# EAGLE schematic harp rfid reader (EAGLE 9.5.1)

## Sheet 1 of 2
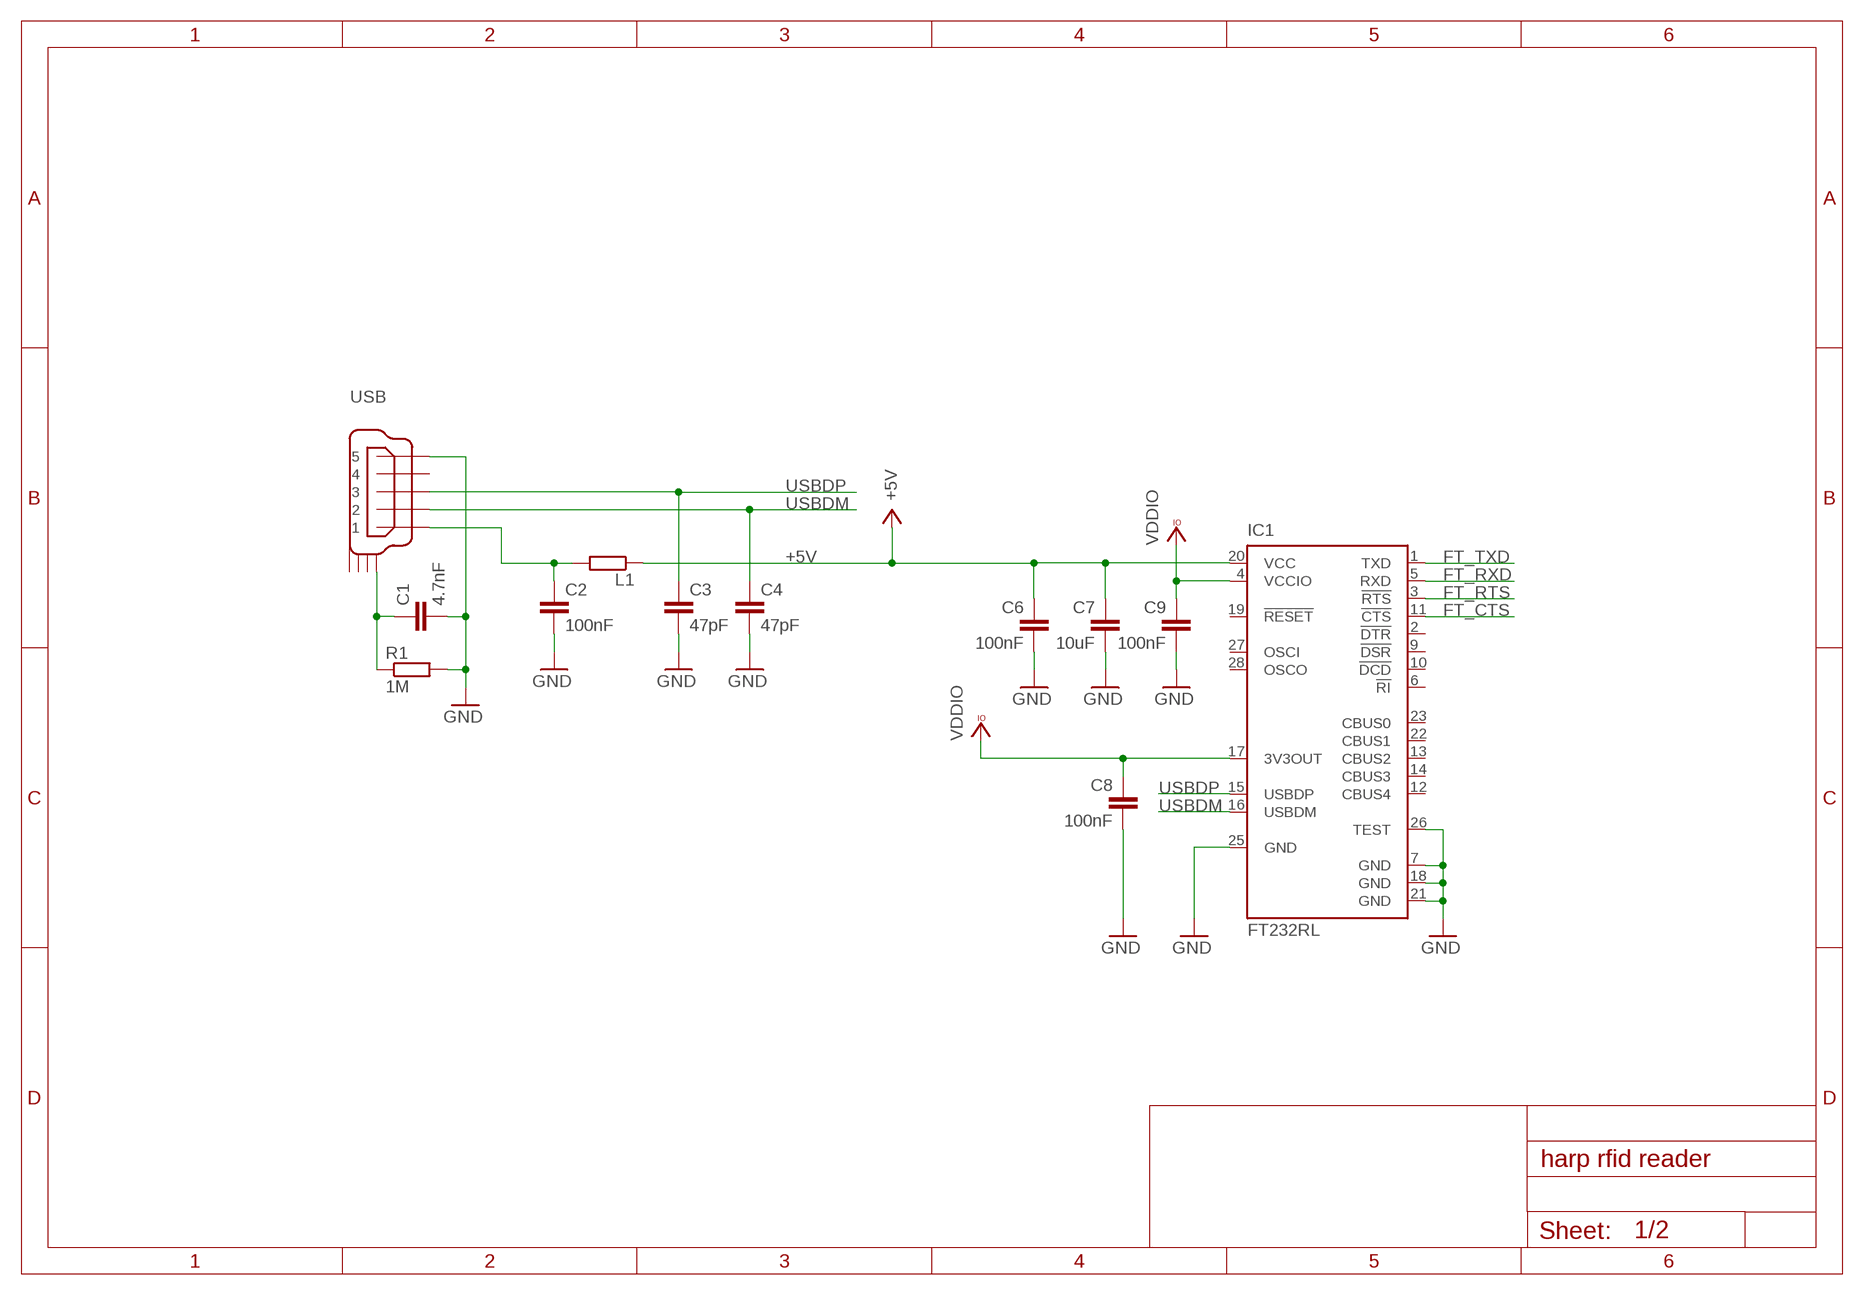
[diagram p0: schematic, sheet 1]

### Parts
C1  4.7nF  C-EUC0402  [C0402]
C2  100nF  C-EUC0402  [C0402]
C3  47pF  C-EUC0402  [C0402]
C4  47pF  C-EUC0402  [C0402]
C6  100nF  C-EUC0402  [C0402]
C7  10uF  C-EUC0603  [C0603]
C8  100nF  C-EUC0402  [C0402]
C9  100nF  C-EUC0402  [C0402]
IC1  FT232RL  [SSOP28]
L1  ???  R-EU_R0805  [R0805]
R1  1M  R-EU_R0402  [R0402]
USB  USB_MINI_B  [240-0002-1]

### Nets
+5V: C6.1 C7.1 IC1.20(VCC) L1.1 ; also sheet 2
FT_CTS: IC1.11(!CTS) ; also sheet 2
FT_RTS: IC1.3(!RTS) ; also sheet 2
FT_RXD: IC1.5(RXD) ; also sheet 2
FT_TXD: IC1.1(TXD) ; also sheet 2
GND: C1.2 C2.2 C3.2 C4.2 C6.2 C7.2 C8.2 C9.2 IC1.7(GND) IC1.18(GND) IC1.21(GND) IC1.25(GND) IC1.26(TEST) R1.2 USB.P$5 ; also sheet 2
N$3: C1.1 R1.1 USB.SHIELD_1
N$39: C2.1 L1.2 USB.P$1
USBDM: C4.1 IC1.16(USBDM) USB.P$2
USBDP: C3.1 IC1.15(USBDP) USB.P$3
VCCIO: C8.1 C9.1 IC1.4(VCCIO) IC1.17(3V3OUT) ; supply symbol labelled VDDIO ; also sheet 2
Unconnected: IC1.2(!DTR) IC1.6(!RI) IC1.9(!DSR) IC1.10(!DCD) IC1.12(CBUS4) IC1.13(CBUS2) IC1.14(CBUS3) IC1.19(!RESET) IC1.22(CBUS1) IC1.23(CBUS0) IC1.27(OSCI) IC1.28(OSCO) USB.P$4 USB.SHIELD_2 USB.SHIELD_3 USB.SHIELD_4

## Sheet 2 of 2
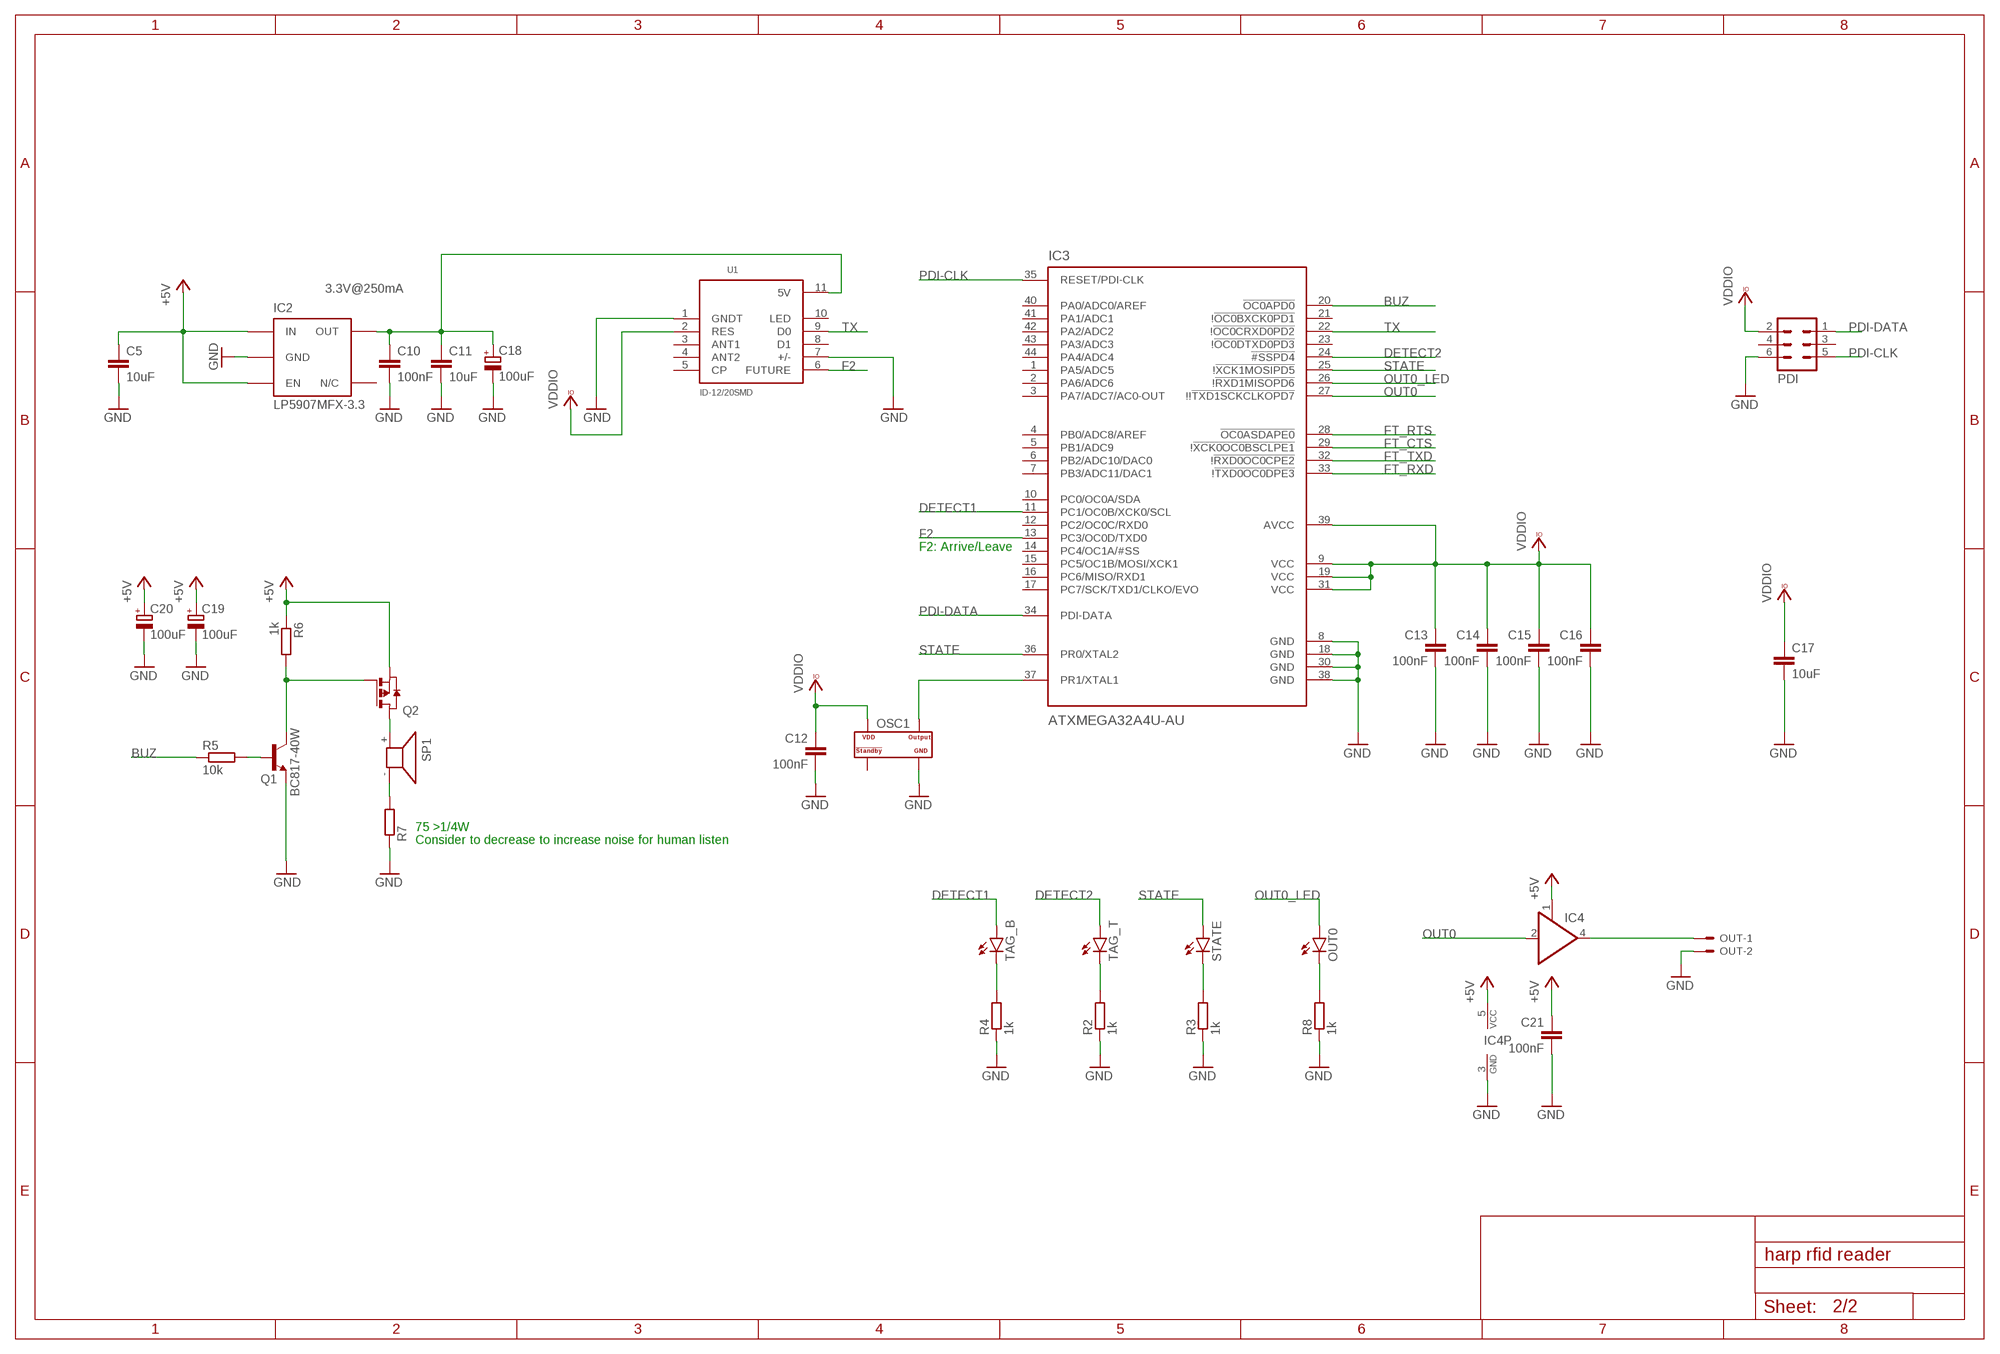
[diagram p1: schematic, sheet 2]

### Parts
C5  10uF  C-EUC0603  [C0603]
C10  100nF  C-EUC0402  [C0402]
C11  10uF  C-EUC0603  [C0603]
C12  100nF  C-EUC0402  [C0402]
C13  100nF  C-EUC0402  [C0402]
C14  100nF  C-EUC0402  [C0402]
C15  100nF  C-EUC0402  [C0402]
C16  100nF  C-EUC0402  [C0402]
C17  10uF  C-EUC0603  [C0603]
C18  100uF  CPOL-EUCT3216  [CT3216]
C19  100uF  CPOL-EUCT3216  [CT3216]
C20  100uF  CPOL-EUCT3216  [CT3216]
C21  100nF  C-EUC0402  [C0402]
IC2  LP5907MFX-3.3  TLV700XX  [TSOT23-5]
IC3  ATXMEGA32A4U-AU  AT-XMEGA-XXA4-AU  [QFP80P1200X1200X120-44N]
IC4  74AHC1G126DBV  [SOT23-5]
OSC1  CNP-MISCELLANEOUS_OSCILLATOR  [CNP-MISCELLANEOUS_OSCILLATOR_3.2X2.5]
OUT  22-23-2021  [22-23-2021]
OUT0  LEDCHIP-LED0603  [CHIP-LED0603]
PDI  MA03-2  [MA03-2]
Q1  BC817-40W  BC817  [SOT323-BEC]
Q2  PMOSSOT223  [SOT223]
R2  1k  R-EU_R0402  [R0402]
R3  1k  R-EU_R0402  [R0402]
R4  1k  R-EU_R0402  [R0402]
R5  10k  R-EU_R0402  [R0402]
R6  1k  R-EU_R0402  [R0402]
R7  75 >1/4W  R-EU_R0402  [R0402]
R8  1k  R-EU_R0402  [R0402]
SP1  BUZZER-COIL_SMT-0540-S-R  [BUZZER-COIL_SMT-0540-S-R]
STATE  LEDCHIP-LED0603  [CHIP-LED0603]
TAG_B  LEDCHIP-LED0603  [CHIP-LED0603]
TAG_T  LEDCHIP-LED0603  [CHIP-LED0603]
U1  ID-12/20SMD  [ID-12_SMD]

### Nets
+5V: C5.1 C19.+ C20.+ C21.1 IC2.1(IN) IC2.3(EN) IC4.1(OE) IC4.5(VCC) Q2.3(S) R6.1 ; also sheet 1
BUZ: IC3.20(!OC0APD0) R5.1
BUZ_T: Q2.2(D) Q2.4(D) SP1.+
DETECT1: IC3.11(PC1/OC0B/XCK0/SCL) TAG_B.A
DETECT2: IC3.24(!#SSPD4) TAG_T.A
F2: IC3.13(PC3/OC0D/TXD0) U1.6(FUTURE)
FT_CTS: IC3.29(!!XCK0OC0BSCLPE1) ; also sheet 1
FT_RTS: IC3.28(!OC0ASDAPE0) ; also sheet 1
FT_RXD: IC3.33(!!TXD0OC0DPE3) ; also sheet 1
FT_TXD: IC3.32(!!RXD0OC0CPE2) ; also sheet 1
GND: C5.2 C10.2 C11.2 C12.2 C13.2 C14.2 C15.2 C16.2 C17.2 C18.- C19.- C20.- C21.2 IC2.2(GND) IC3.8(GND) IC3.18(GND) IC3.30(GND) IC3.38(GND) IC4.3(GND) OSC1.P$2(GND) OUT.2 PDI.6 Q1.E R2.1 R3.1 R4.1 R7.1 R8.1 U1.1(GNDT) U1.7(+/-) ; also sheet 1
N$1: C10.1 C11.1 C18.+ IC2.5(OUT) U1.11(5V)
N$2: R3.2 STATE.C
N$4: R4.2 TAG_B.C
N$5: R2.2 TAG_T.C
N$6: OUT0.C R8.2
N$7: IC4.4(O) OUT.1
N$20: R7.2 SP1.-
N$25: Q1.C Q2.1(G) R6.2
N$27: Q1.B R5.2
OSC1: IC3.37(PR1/XTAL1) OSC1.P$3(OUTPUT)
OUT0: IC3.27(!!!TXD1SCKCLKOPD7) IC4.2(I)
OUT0_LED: IC3.26(!!RXD1MISOPD6) OUT0.A
PDI-CLK: IC3.35(RESET/PDI-CLK) PDI.5
PDI-DATA: IC3.34(PDI-DATA) PDI.1
STATE: IC3.25(!!XCK1MOSIPD5) IC3.36(PR0/XTAL2) STATE.A
TX: IC3.22(!!OC0CRXD0PD2) U1.9(D0)
VCCIO: C12.1 C13.1 C14.1 C15.1 C16.1 C17.1 IC3.9(VCC) IC3.19(VCC) IC3.31(VCC) IC3.39(AVCC) OSC1.P$4(VDD) PDI.2 U1.2(RES) ; supply symbol labelled VDDIO ; also sheet 1
Unconnected: IC2.4(N/C) IC3.1(PA5/ADC5) IC3.2(PA6/ADC6) IC3.3(PA7/ADC7/AC0-OUT) IC3.4(PB0/ADC8/AREF) IC3.5(PB1/ADC9) IC3.6(PB2/ADC10/DAC0) IC3.7(PB3/ADC11/DAC1) IC3.10(PC0/OC0A/SDA) IC3.12(PC2/OC0C/RXD0) IC3.14(PC4/OC1A/#SS) IC3.15(PC5/OC1B/MOSI/XCK1) IC3.16(PC6/MISO/RXD1) IC3.17(PC7/SCK/TXD1/CLKO/EVO) IC3.21(!!OC0BXCK0PD1) IC3.23(!!OC0DTXD0PD3) IC3.40(PA0/ADC0/AREF) IC3.41(PA1/ADC1) IC3.42(PA2/ADC2) IC3.43(PA3/ADC3) IC3.44(PA4/ADC4) OSC1.P$1(STANDBY#) PDI.3 PDI.4 U1.3(ANT1) U1.4(ANT2) U1.5(CP) U1.8(D1) U1.10(LED)

### Notes on the sheet
- 3.3V@250mA
- F2: Arrive/Leave
- 75 >1/4W
- Consider to decrease to increase noise for human listen

## Library data of the parts
C1-C17 C21 = rcl:C-EU: CAPACITOR, European symbol
C18-C20 = rcl:CPOL-EU: POLARIZED CAPACITOR, European symbol; SPICEPREFIX: C
IC1 = ftdichip:FT232R: Source: http://www.ftdichip.com/Documents/DataSheets/DS_FT232R_v104.pdf; MPN: FT232RL; OC_FARNELL: 1146032; OC_NEWARK: 91K9918
IC2 = CNP:TLV700XX
IC3 = xmega-a4:AT-XMEGA-XXA4-AU: ATxMega a4 Serie
IC4 = 74xx-little-de:74*1G126: Single Bus Buffer Gate With 3-State Outputs
L1 R1 R5-R7 = rcl:R-EU_: RESISTOR, European symbol
OSC1 = harp rfid reader v1.0:CNP-MISCELLANEOUS_OSCILLATOR
OUT = con-molex:22-23-2021: .100" (2.54mm) Center Header - 2 Pin; MF: MOLEX; MPN: 22-23-2021; OC_FARNELL: 1462926; OC_NEWARK: 25C3832
OUT0 STATE TAG_B TAG_T = led:LED: LED OSRAM: - CHIPLED LG R971, LG N971, LY N971, LG Q971, LY Q971, LO R971, LY R971 LH N974, LH R974 LS Q976, LO Q976, LY Q976 LO Q996 - Hyper CHIPLED LW Q18S LB Q993, LB Q99A, LB R99A - SideLED LS A670, LO A670, LY A670, LG A670, LP A670 LB A673, LV A673, LT A673, LW A673 LH A674 LY A675 LS A676, LA A676, LO A676, LY A676, LW A676 LS A679, LY A679, LG A679 - Hyper Micro SIDELED® LS Y876, LA Y876, LO Y876, LY Y876 LT Y87S - SmartLED LW L88C, LW L88S LB L89C, LB L89S, LG L890 LS L89K, LO L89K, LY L89K LS L896, LA L896, LO L896, LY L896 - TOPLED LS T670, LO T670, LY T670, LG T670, LP T670 LSG T670, LSP T670, LSY T670, LOP T670, LYG T670 LG T671, LOG T671, LSG T671 LB T673, LV T673, LT T673, LW T673 LH T674 LS T676, LA T676, LO T676, LY T676, LB T676, LH T676, LSB T676, LW T676 LB T67C, LV T67C, LT T67C, LS T67K, LO T67K, LY T67K, LW E67C LS E67B, LA E67B, LO E67B, LY E67B, LB E67C, LV E67C, LT E67C LW T67C LS T679, LY T679, LG T679 LS T770, LO T770, LY T770, LG T770, LP T770 LB T773, LV T773, LT T773, LW T773 LH T774 LS E675, LA E675, LY E675, LS T675 LS T776, LA T776, LO T776, LY T776, LB T776 LHGB T686 LT T68C, LB T68C - Hyper Mini TOPLED® LB M676 - Mini TOPLED Santana® LG M470 LS M47K, LO M47K, LY M47K Source: http://www.osram.convergy.de LUXEON: - LUMILED® LXK2-PW12-R00, LXK2-PW12-S00, LXK2-PW14-U00, LXK2-PW14-V00 LXK2-PM12-R00, LXK2-PM12-S00, LXK2-PM14-U00 LXK2-PE12-Q00, LXK2-PE12-R00, LXK2-PE12-S00, LXK2-PE14-T00, LXK2-PE14-U00 LXK2-PB12-K00, LXK2-PB12-L00, LXK2-PB12-M00, LXK2-PB14-N00, LXK2-PB14-P00, LXK2-PB14-Q00 LXK2-PR12-L00, LXK2-PR12-M00, LXK2-PR14-Q00, LXK2-PR14-R00 LXK2-PD12-Q00, LXK2-PD12-R00, LXK2-PD12-S00 LXK2-PH12-R00, LXK2-PH12-S00 LXK2-PL12-P00, LXK2-PL12-Q00, LXK2-PL12-R00 Source: www.luxeon.com KINGBRIGHT: KA-3528ASYC Source: www.kingbright.com
PDI = con-lstb:MA03-2: PIN HEADER; OC_FARNELL: unknown; OC_NEWARK: unknown
Q1 = transistor-npn:BC817*: NPN Transistor
Q2 = zetex:PMOSSOT223: MOS FET; OC_FARNELL: unknown; OC_NEWARK: unknown
R2-R4 R8 = rcl:R-EU_: RESISTOR, European symbol; SPICEPREFIX: R
SP1 = harp rfid reader v1.0:BUZZER-COIL_SMT-0540-S-R: Buzzers Magnetic Transducer Source: PUI Audio
U1 = SparkFun:ID-12/20: ID2, ID12, and ID20 Package
USB = CNP-connectors:USB_MINI_B